# EAGLE design gismov (EAGLE 7.4.0)
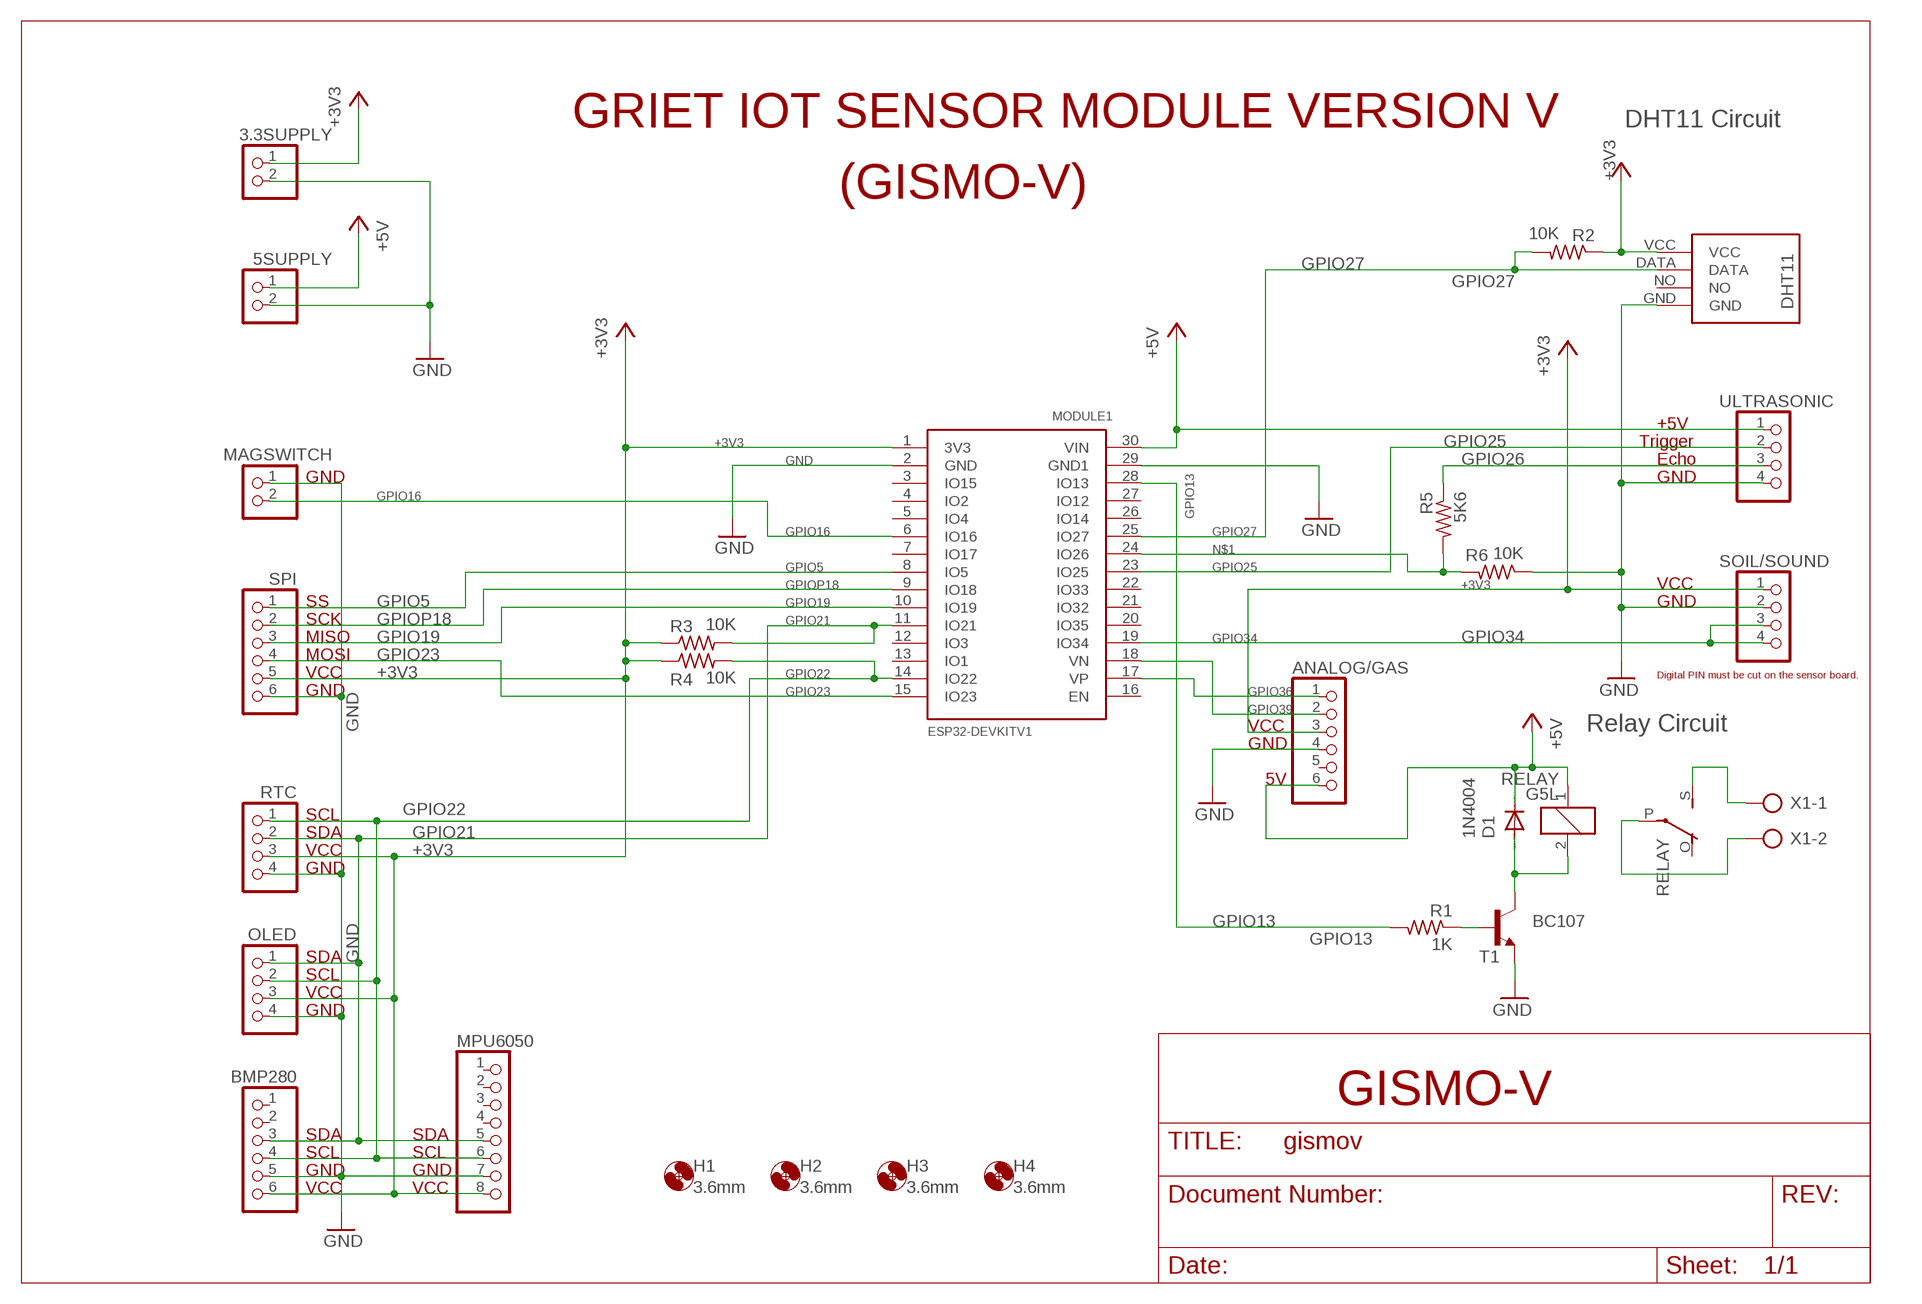
[diagram p0: schematic, sheet 1]

## Parts
3.3SUPPLY  PINHD-1X2  [1X02]
5SUPPLY  PINHD-1X2  [1X02]
ANALOG/GAS  PINHD-1X6  [1X06]
BMP280  PINHD-1X6  [1X06]
D1  1N4004  [DO41-10]
H1  3.6mm  MOUNT-HOLE3.6  [3,6]
H2  3.6mm  MOUNT-HOLE3.6  [3,6]
H3  3.6mm  MOUNT-HOLE3.6  [3,6]
H4  3.6mm  MOUNT-HOLE3.6  [3,6]
MAGSWITCH  PINHD-1X2  [1X02]
MODULE1  ESP32DEVKITV1  [ESP32-DEVKITV1]
MPU6050  PINHD-1X8  [1X08]
OLED  PINHD-1X4  [1X04]
R1  1K  R-US_0204/7  [0204/7]
R2  10K  R-US_0204/7  [0204/7]
R3  10K  R-US_0204/7  [0204/7]
R4  10K  R-US_0204/7  [0204/7]
R5  5K6  R-US_0204/7  [0204/7]
R6  10K  R-US_0204/7  [0204/7]
RELAY  G5L  [G5LE]
RTC  PINHD-1X4  [1X04]
SOIL/SOUND  PINHD-1X4  [1X04]
SPI  PINHD-1X6  [1X06]
T1  BC107  BC107A-NPN-TO18-EBC  [TO18]
U$2  DHT11  [DHT11]
ULTRASONIC  PINHD-1X4  [1X04]
X1  AK500/2  [AK500/2]

## Nets
+3V3: 3.3SUPPLY.1 ANALOG/GAS.3 BMP280.6 MODULE1.1(3V3) MPU6050.8 OLED.3 R2.1 R3.1 R4.1 RTC.3 SOIL/SOUND.1 SPI.5 U$2.VCC
+5V: 5SUPPLY.1 ANALOG/GAS.6 D1.C MODULE1.30(VIN) RELAY.1 ULTRASONIC.1
GND: 3.3SUPPLY.2 5SUPPLY.2 ANALOG/GAS.4 BMP280.5 MAGSWITCH.1 MODULE1.2(GND) MODULE1.29(GND1) MPU6050.7 OLED.4 R6.1 RTC.4 SOIL/SOUND.2 SPI.6 T1.1(E) U$2.GND ULTRASONIC.4
GPIO5: MODULE1.8(IO5) SPI.1
GPIO13: MODULE1.28(IO13) R1.2
GPIO16: MAGSWITCH.2 MODULE1.6(IO16)
GPIO19: MODULE1.10(IO19) SPI.3
GPIO21: BMP280.3 MODULE1.11(IO21) MPU6050.5 OLED.1 R3.2 RTC.2
GPIO22: BMP280.4 MODULE1.14(IO22) MPU6050.6 OLED.2 R4.2 RTC.1
GPIO23: MODULE1.15(IO23) SPI.4
GPIO25: MODULE1.23(IO25) ULTRASONIC.2
GPIO26: R5.1 ULTRASONIC.3
GPIO27: MODULE1.25(IO27) R2.2 U$2.DATA
GPIO34: MODULE1.19(IO34) SOIL/SOUND.3 SOIL/SOUND.4
GPIO36: ANALOG/GAS.1 MODULE1.17(VP)
GPIO39: ANALOG/GAS.2 MODULE1.18(VN)
GPIOP18: MODULE1.9(IO18) SPI.2
N$1: MODULE1.24(IO26) R5.2 R6.2
N$8: D1.A RELAY.2 T1.3(C)
N$9: RELAY.P(2:P) X1.2
N$10: RELAY.S(2:S) X1.1
N$11: R1.1 T1.2(B)
Unconnected: ANALOG/GAS.5 BMP280.1 BMP280.2 MODULE1.3(IO15) MODULE1.4(IO2) MODULE1.5(IO4) MODULE1.7(IO17) MODULE1.12(IO3) MODULE1.13(IO1) MODULE1.16(EN) MODULE1.20(IO35) MODULE1.21(IO32) MODULE1.22(IO33) MODULE1.26(IO14) MODULE1.27(IO12) MPU6050.1 MPU6050.2 MPU6050.3 MPU6050.4 RELAY.O(2:O) U$2.NO

## Notes on the sheet
- GRIET IOT SENSOR MODULE VERSION V | DHT11 Circuit
- (GISMO-V)
- +5V
- Trigger
- Echo
- GND | GND
- VCC
- SS | GND
- SCK
- MISO
- MOSI
- VCC | Digital PIN must be cut on the sensor board.
- GND
- VCC | Relay Circuit
- GND
- 5V
- SCL
- SDA
- VCC
- GND
- SDA
- SCL
- VCC
- GND
- GISMO-V
- SDA | SDA
- SCL | SCL
- GND | GND
- VCC | VCC

## Library data of the parts
3.3SUPPLY 5SUPPLY MAGSWITCH = pinhead01:PINHD-1X2: PIN HEADER
ANALOG/GAS BMP280 SPI = pinhead01:PINHD-1X6: PIN HEADER
D1 = diode:1N4004: DIODE general purpose rectifier, 1 A
H1-H4 = holes:MOUNT-HOLE: MOUNTING HOLE with drill center marker
MODULE1 = ESP32-DEVKITV1:ESP32DEVKITV1
MPU6050 = pinhead01:PINHD-1X8: PIN HEADER
OLED RTC SOIL/SOUND ULTRASONIC = pinhead01:PINHD-1X4: PIN HEADER
R1-R6 = rcl:R-US_: RESISTOR, American symbol
RELAY = relay:G5L: RELAY 1 x switch, 10 A/120 V AC, 8 A/30 V ADC, Omron; OC_FARNELL: unknown; OC_NEWARK: unknown
T1 = transistor:*-NPN-: NPN Transistror BF959 corrected 2008.03.06
U$2 = DHT11:DHT11: DHT11 Czujnik temperatury i wilgotności
X1 = con-ptr500:AK500/2: CONNECTOR; OC_FARNELL: unknown; OC_NEWARK: unknown

## Board
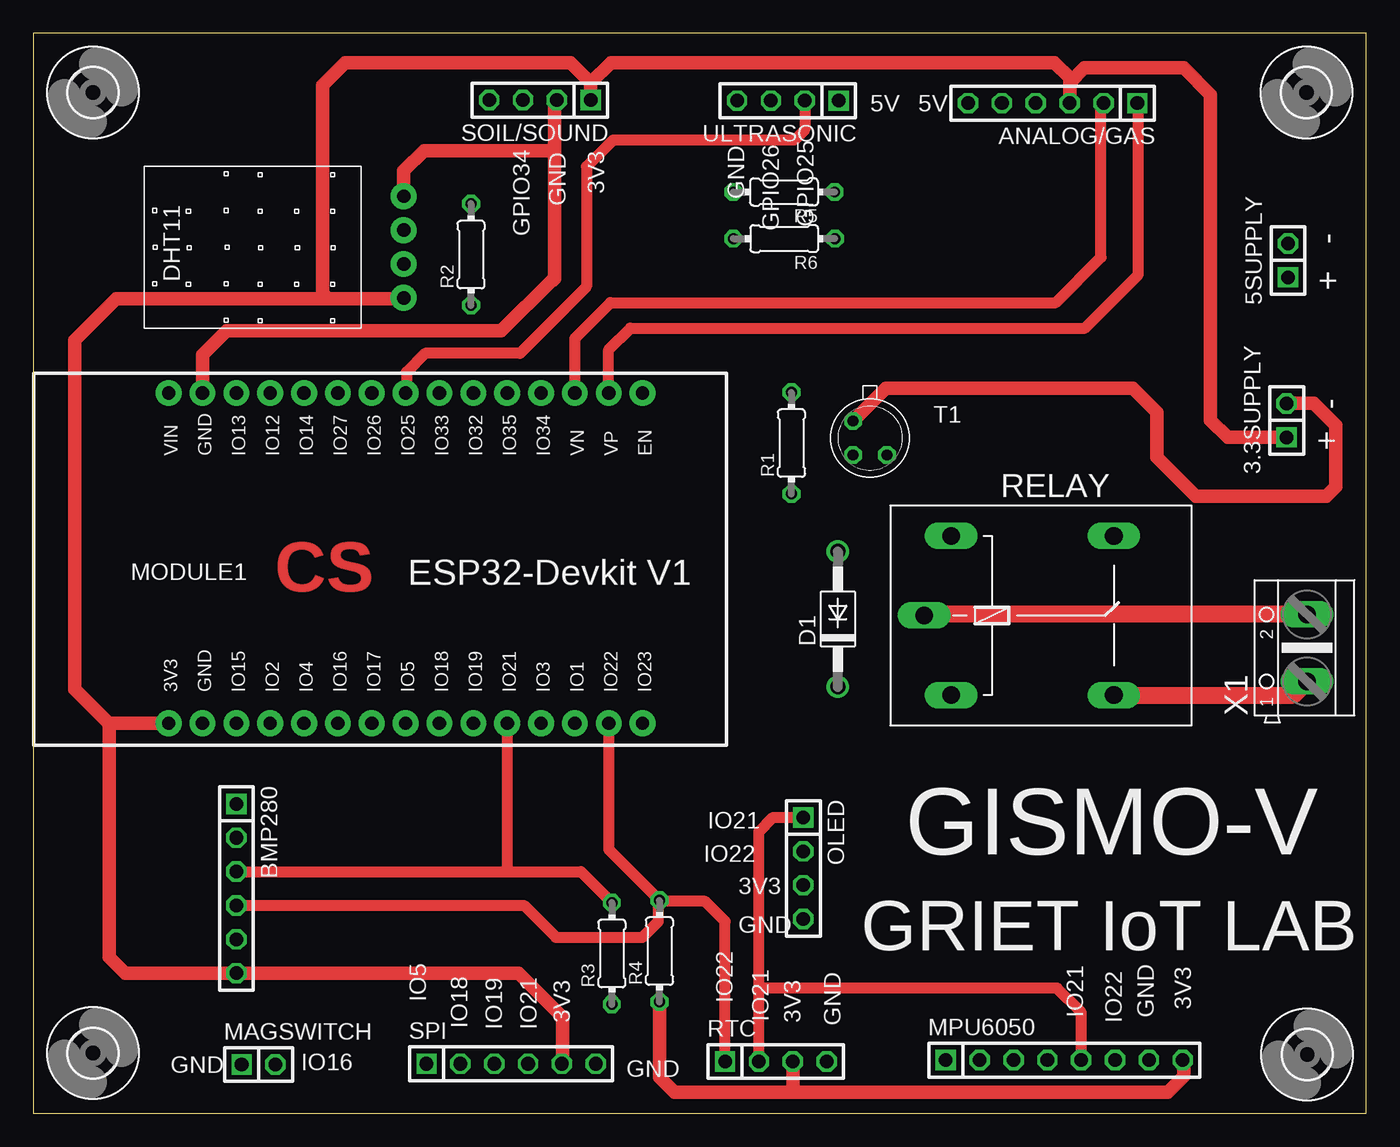
[diagram p1: board, top side]
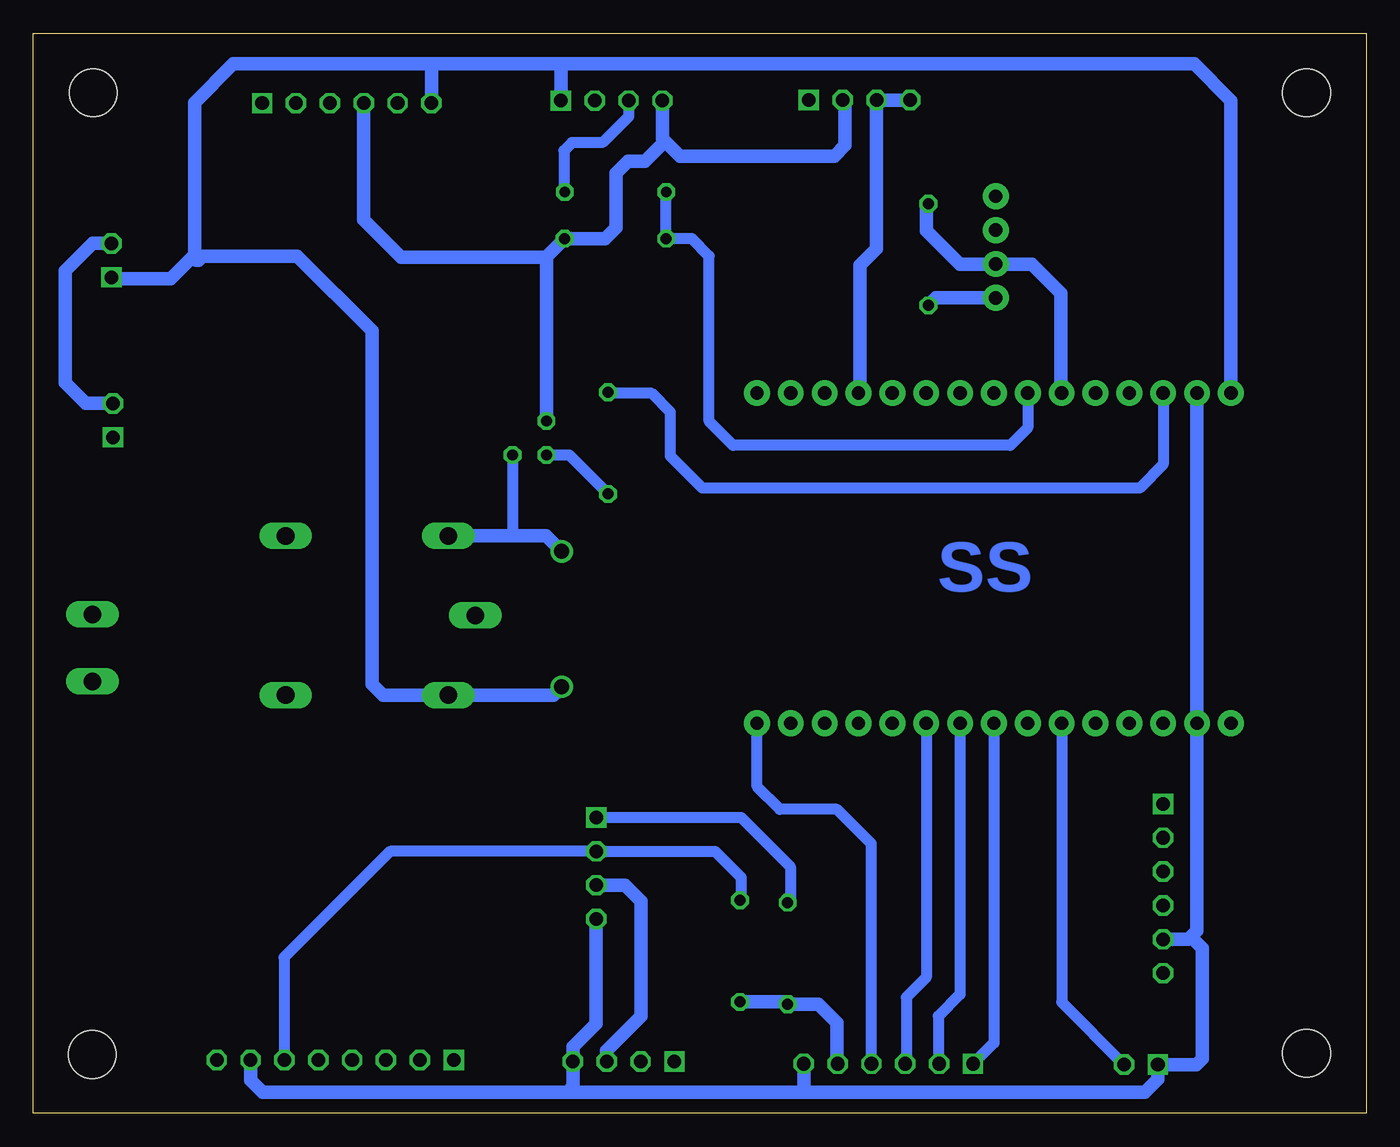
[diagram p2: board, bottom side, seen from below]

Size 100 x 81 mm. Coordinates in mm from the lower left corner, seen from the top.
Outline: 0,0 100,0 100,81 0,81 0,0
Copper layers (1*16): Top 0.035mm / dielectric 1.5mm / Bottom 0.035mm
Design rules "default": minimum track width 10mil, minimum drill 24mil, track to track 8mil, track to pad 8mil, pad to pad 8mil, via to via 8mil, smd to smd 8mil, copper to edge 40mil, drill to drill 8mil, minimum pad ring 10mil, minimum via ring 8mil, stop-mask expansion 4mil, vias tented up to drill 0mil, thermal gap 10mil

### Footprints (pad centres in the part's own frame; a part is rotated, then mirrored left to right if it is on the bottom)
1X02 = drill 1.016 square: 1 -1.27,0 | drill 1.016 octagon: 2 1.27,0
1X06 = drill 1.016 square: 1 -6.35,0 | drill 1.016 octagon: 2 -3.81,0; 3 -1.27,0; 4 1.27,0; 5 3.81,0; 6 6.35,0
DO41-10 = drill 1.118: A 5.08,0; C -5.08,0
3,6 = hole 3.6: 0,0
ESP32-DEVKITV1 = drill 1 pad 1.93: 1 -22.87,-13.54; 2 -20.33,-13.54; 3 -17.79,-13.54; 4 -15.25,-13.54; 5 -12.71,-13.54; 6 -10.17,-13.54; 7 -7.63,-13.54; 8 -5.09,-13.54; 9 -2.55,-13.54; 10 -0.01,-13.54; 11 2.53,-13.54; 12 5.07,-13.54; 13 7.61,-13.54; 14 10.15,-13.54; 15 12.69,-13.54; 16 12.69,11.23; 17 10.15,11.23; 18 7.61,11.23; 19 5.07,11.23; 20 2.53,11.23; 21 -0.01,11.23; 22 -2.55,11.23; 23 -5.09,11.23; 24 -7.63,11.23; 25 -10.17,11.23; 26 -12.71,11.23; 27 -15.25,11.23; 28 -17.79,11.23; 29 -20.33,11.23; 30 -22.87,11.23
1X08 = drill 1.016 square: 1 -8.89,0 | drill 1.016 octagon: 2 -6.35,0; 3 -3.81,0; 4 -1.27,0; 5 1.27,0; 6 3.81,0; 7 6.35,0; 8 8.89,0
1X04 = drill 1.016 square: 1 -3.81,0 | drill 1.016 octagon: 2 -1.27,0; 3 1.27,0; 4 3.81,0
0204/7 = drill 0.813 octagon: 1 -3.81,0; 2 3.81,0
G5LE = drill 1.321 long: 1 -7.493,-5.969; 2 -7.493,5.969; O 4.699,5.969; P -9.525,0; S 4.699,-5.969
TO18 = drill 0.813 octagon: 1 -1.27,-1.27; 2 1.27,-1.27; 3 1.27,1.27
DHT11 = drill 1 pad 1.93: DATA -1.27,-11.43; GND 3.81,-11.43; NO 1.27,-11.43; VCC -3.81,-11.43
AK500/2 = drill 1.321 long: 1 -2.515,0; 2 2.515,0

### Placement (x,y rotation side)
3.3SUPPLY  94.03,51.97 90 top
5SUPPLY  94.14,63.97 90 top
ANALOG/GAS  76.48,75.76 180 top
BMP280  15.24,16.86 270 top
D1  60.36,37.07 90 top
H1  4.48,4.51 0 top
H2  95.51,76.55 0 top
H3  4.48,76.55 0 top
H4  95.58,4.41 0 top
MAGSWITCH  16.9,3.66 0 top
MODULE1  33.02,42.8 0 top
MPU6050  77.35,3.99 0 top
OLED  57.77,18.38 270 top
R1  56.88,50.27 90 top
R2  32.84,64.41 90 top
R3  43.41,11.99 90 top
R4  46.98,12.17 90 top
R5  56.32,69.1 180 top
R6  56.33,65.6 180 top
RELAY  76.37,37.34 0 top
RTC  55.71,3.89 0 top
SOIL/SOUND  38.01,75.99 180 top
SPI  35.85,3.72 0 top
T1  62.77,50.65 270 top
U$2  16.36,64.97 90 top
ULTRASONIC  56.61,75.95 180 top
X1  95.56,34.91 90 top

### Tracks (layer width: path | path; a pad name or v marks a point on that pad's centre or on a via)
+3V3
  Top 1.016: MODULE1.1 5.8,29.26 | 5.8,29.26 5.64,29.26 3.1,31.8 3.1,58 6.2,61.1 22.1,61.1 | 22.1,61.1 27.73,61.1 U$2.VCC | SOIL/SOUND.1 41.82,77.28 | 41.82,77.28 40.3,78.8 23.4,78.8 21.7,77.1 21.7,61.5 22.1,61.1 | ANALOG/GAS.3 77.75,77.3 | 77.75,77.3 77.75,77.65 76.6,78.8 43.34,78.8 41.82,77.28 | 3.3SUPPLY.1 89.6,50.7 88.3,52 88.3,76.4 86.3,78.4 78.85,78.4 77.75,77.3 | 5.8,29.26 5.7,29.16 5.7,11.7 6.89,10.51 BMP280.6 36.39,10.51 39.7,7.2 39.7,3.76 SPI.5 | R4.1 46.98,2.72 48.1,1.6 56.9,1.6 | 56.9,1.6 85.1,1.6 86.3,2.8 86.3,3.93 MPU6050.8 | RTC.3 56.98,1.68 56.9,1.6
  Bottom 1.016: U$2.VCC 32.28,61.16 R2.1 | R4.1 43.59,8.36 R3.1 41.08,8.18 39.7,6.8 39.7,3.76 SPI.5 | OLED.3 55.6,17.1 54.4,15.9 54.4,7.3 57,4.7 57,3.91 RTC.3
+5V
  Bottom 1.016: MODULE1.30 10.15,75.95 12.9,78.7 60.4,78.7 | 60.4,78.7 70.2,78.7 | 70.2,78.7 85,78.7 87.9,75.8 87.9,64.4 88.05,64.25 | 88.05,64.25 89.7,62.6 94.04,62.6 5SUPPLY.1 | 88.05,64.25 87.8,64 87.6,64 87.3,64.3 80.2,64.3 74.6,58.7 74.6,32.2 73.77,31.37 RELAY.1 60.98,31.37 D1.C | ULTRASONIC.1 60.42,78.68 60.4,78.7 | ANALOG/GAS.6 70.13,78.63 70.2,78.7
GND
  Top 1.016: MODULE1.29 12.69,56.89 14.5,58.7 35.1,58.7 38.9,62.5 39,62.5 39.1,62.6 39.1,72.2 | 39.1,72.2 39.1,75.81 SOIL/SOUND.2 | U$2.GND 27.79,70.69 29.3,72.2 39.1,72.2 | 3.3SUPPLY.2 96.06,53.24 97.7,51.6 97.7,47 97,46.3 87.2,46.3 84.3,49.2 84.3,52.6 82.5,54.4 63.98,54.4 T1.1
  Bottom 1.016: ULTRASONIC.4 52.8,73.1 52.6,72.9 | 52.6,72.9 51.5,71.8 39.9,71.8 39.1,72.6 39.1,75.81 SOIL/SOUND.2 | T1.1 61.5,63.9 | 61.5,63.9 61.5,64.24 R6.1 57.1,65.6 56.3,66.4 56.3,70.5 55.4,71.4 54.1,71.4 52.6,72.9 | ANALOG/GAS.4 75.21,67.01 72.4,64.2 61.8,64.2 61.5,63.9 | 5SUPPLY.2 95.56,65.24 97.6,63.2 97.6,54.78 96.06,53.24 3.3SUPPLY.2 | MODULE1.29 MODULE1.2 12.7,13.7 13.15,13.25 | BMP280.5 13.35,13.05 13.15,13.25 | 13.15,13.25 12.3,12.4 12.3,4.1 12.74,3.66 MAGSWITCH.1 15.63,2.57 16.6,1.6 42.2,1.6 | OLED.4 57.77,6.73 59.5,5 59.5,3.91 RTC.4 59.52,1.98 59.9,1.6 | 42.2,1.6 59.9,1.6 | 59.9,1.6 82.8,1.6 83.7,2.5 MPU6050.7 | SPI.6 42.2,1.6
GPIO5
  Bottom 0.813: MODULE1.8 27.93,5.29 SPI.1
GPIO13
  Bottom 0.813: MODULE1.28 15.23,48.67 17,46.9 49.8,46.9 52.2,49.3 52.2,52.6 53.6,54 56.8,54
  Bottom 1.016: 56.8,54 R1.2
GPIO16
  Bottom 0.813: MODULE1.6 22.85,8.34 MAGSWITCH.2
GPIO19
  Bottom 0.813: MODULE1.10 33.01,10.19 34.5,8.7 34.5,3.8 SPI.3
GPIO21
  Top 0.813: BMP280.3 35.8,18.13 | 35.8,18.13 41.08,18.13 R3.2 | MODULE1.11 35.55,18.38 35.8,18.13 | RTC.2 54.44,9.3 | 54.44,9.3 54.44,21.13 55.5,22.19 OLED.1 | MPU6050.5 78.62,7.58 76.8,9.4 54.54,9.4 54.44,9.3
  Bottom 0.813: OLED.1 46.89,22.19 43.2,18.5 43.2,16.01 R3.2
GPIO22
  Top 0.813: BMP280.4 36.81,15.59 39.2,13.2 45.7,13.2 46.9,14.4 46.9,15.9 R4.2 | MODULE1.14 43.17,19.79 R4.2 | RTC.1 51.9,14.4 50.4,15.9 47.06,15.9 R4.2
  Bottom 0.813: R4.2 46.9,16.06 46.9,17.7 48.85,19.65 OLED.2 73.25,19.65 81.2,11.7 81.2,4.03 MPU6050.6
GPIO23
  Bottom 0.813: SPI.4 37.12,20.22 39.7,22.8 44,22.8 45.7,24.5 MODULE1.15
GPIO25
  Top 0.813: ULTRASONIC.2 57.88,73.78 57.1,73 43.5,73 41.5,71 41.5,62 36.5,57 29.4,57 28,55.6 28,54.1 MODULE1.23
GPIO26
  Bottom 0.813: ULTRASONIC.3 55.34,74.76 57.3,72.8 59.6,72.8 60.2,72.2 60.2,69.17 R5.1
GPIO27
  Bottom 1.016: R2.2 33,68.06 33,66.2 30.5,63.7 U$2.DATA 25.1,63.7 22.9,61.5 22.9,54.08 MODULE1.25
GPIO34
  Bottom 1.016: MODULE1.19 38,54.12 38,63.6 36.74,64.86 SOIL/SOUND.3 SOIL/SOUND.4
GPIO36
  Top 0.813: MODULE1.17 43.17,57.27 44.8,58.9 78.9,58.9 82.9,62.9 82.9,75.69 ANALOG/GAS.1
GPIO39
  Top 0.813: MODULE1.18 40.63,58.13 43.3,60.8 76.7,60.8 80.1,64.2 80.1,75.57 ANALOG/GAS.2
GPIOP18
  Bottom 0.813: MODULE1.9 30.47,8.93 32.1,7.3 32.1,3.78 SPI.2
N$1
  Bottom 0.813: MODULE1.24 25.39,51.41 26.7,50.1 47.5,50.1 49.3,51.9 49.3,64.3 50.6,65.6 R6.2 R5.2
  Bottom 1.016: R5.2
N$8
  Bottom 0.813: T1.3 64.04,43.35 64,43.31
  Bottom 1.016: RELAY.2 64,43.31 61.52,43.31 D1.A
N$9
  Top 1.27: X1.2 66.93,37.42 RELAY.P
N$10
  Top 1.27: RELAY.S 94.54,31.37 X1.1
N$11
  Bottom 0.813: T1.2 59.8,49.38 R1.1

### Text on the board
Top: CS
Bottom: SS
tNames: 5V | 5V | GND | GPIO26 | GPIO25 | GPIO34 | GND | 3V3 | - | + | - | + | IO21 | IO22 | GISMO-V | 3V3 | GND | GRIET IoT LAB | IO5 | IO22 | 3V3 | 3V3 | IO21 | 3V3 | GND | IO21 | IO22 | GND | IO18 | IO19 | IO21 | GND | IO16 | GND